# EAGLE design megashield_rs485 (EAGLE 7.6.0)
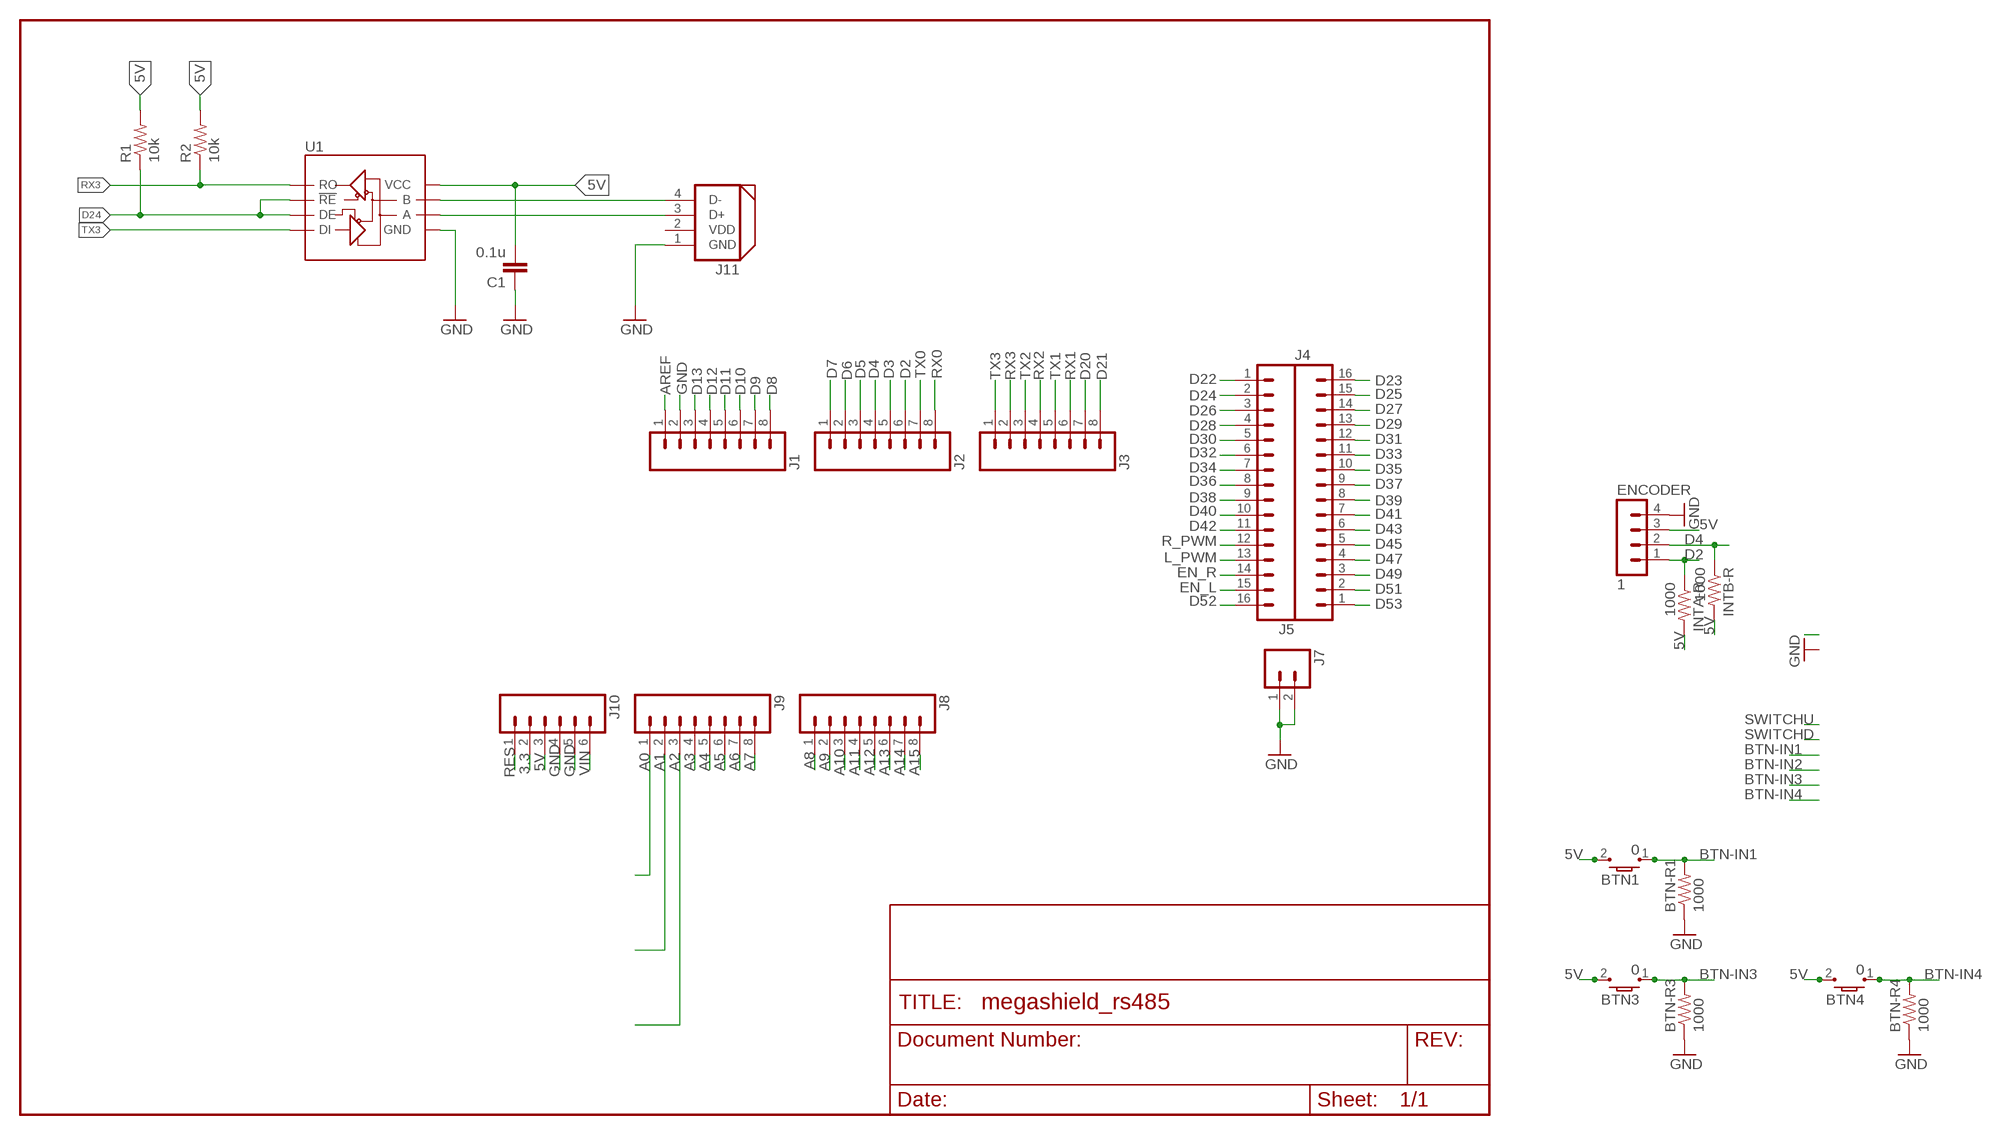
[diagram p0: schematic, sheet 1, part 1 of 2]
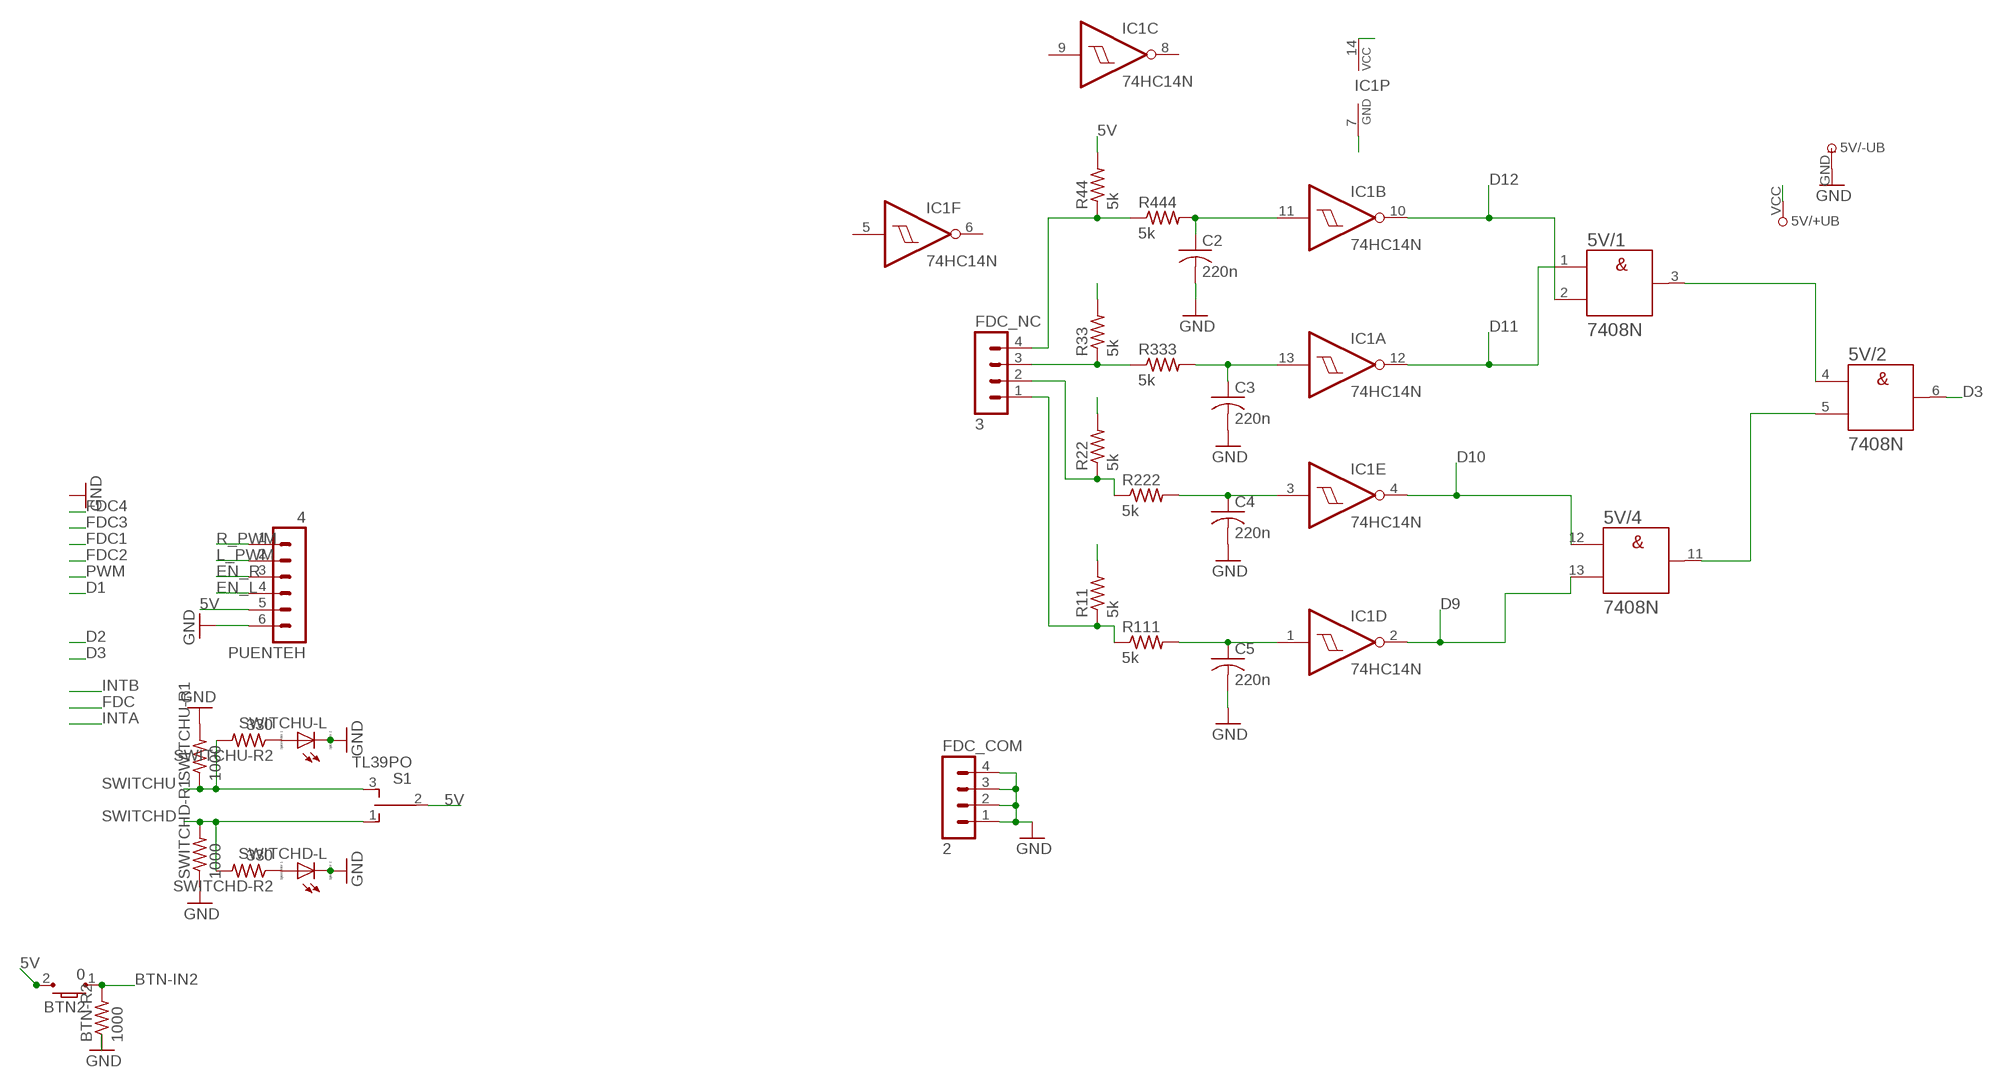
[diagram p1: schematic, sheet 1, part 2 of 2]

## Parts
5V  7408N  [DIL14]
BTN1  0  TL3302-J  [TL3303_J]
BTN2  0  TL3302-J  [TL3303_J]
BTN3  0  TL3302-J  [TL3303_J]
BTN4  0  TL3302-J  [TL3303_J]
BTN-R1  1000  R-US_0204/7  [0204/7]
BTN-R2  1000  R-US_0204/7  [0204/7]
BTN-R3  1000  R-US_0204/7  [0204/7]
BTN-R4  1000  R-US_0204/7  [0204/7]
C1  0.1u  CAPPTH  [CAP-PTH-SMALL]
C2  220n  C-US025-030X050  [C025-030X050]
C3  220n  C-US025-030X050  [C025-030X050]
C4  220n  C-US025-030X050  [C025-030X050]
C5  220n  C-US025-030X050  [C025-030X050]
ENCODER  1  MA04-1  [MA04-1]
FDC_COM  2  MA04-1  [MA04-1]
FDC_NC  3  MA04-1  [MA04-1]
IC1  74HC14N  [DIL14]
INTA-R  1000  R-US_0204/7  [0204/7]
INTB-R  1000  R-US_0204/7  [0204/7]
J1  M08LONGPADS  [1X08_LONGPADS]
J2  M08LONGPADS  [1X08_LONGPADS]
J3  M08LONGPADS  [1X08_LONGPADS]
J4  M16PTH  [1X16]
J5  M16PTH  [1X16]
J7  M02PTH  [1X02]
J8  M08LONGPADS  [1X08_LONGPADS]
J9  M08LONGPADS  [1X08_LONGPADS]
J10  M06LONGPADS  [1X06_LONGPADS]
J11  DYNAMIXEL_RS485  [DYNAMIXEL_SPOX_04]
PUENTEH  4  MA06-1  [MA06-1]
R1  10k  RESISTORPTH-1/4W  [AXIAL-0.4]
R2  10k  RESISTORPTH-1/4W  [AXIAL-0.4]
R11  5k  R-US_0204/7  [0204/7]
R22  5k  R-US_0204/7  [0204/7]
R33  5k  R-US_0204/7  [0204/7]
R44  5k  R-US_0204/7  [0204/7]
R111  5k  R-US_0204/7  [0204/7]
R222  5k  R-US_0204/7  [0204/7]
R333  5k  R-US_0204/7  [0204/7]
R444  5k  R-US_0204/7  [0204/7]
S1  TL39PO  [TL3XPO]
SWITCHD-L  LED_ELD260  [LED_LD260]
SWITCHD-R1  1000  R-US_0204/7  [0204/7]
SWITCHD-R2  330  R-US_0204/7  [0204/7]
SWITCHU-L  LED_ELD260  [LED_LD260]
SWITCHU-R1  1000  R-US_0204/7  [0204/7]
SWITCHU-R2  330  R-US_0204/7  [0204/7]
U1  RS485  SN75176B  [DIL08]

## Nets
3.3: J10.2
5V: 5V.VCC(/+UB:+UB) BTN1.2 BTN2.2 BTN3.2 BTN4.2 C1.2 ENCODER.3 IC1.14(P:VCC) INTA-R.2 INTB-R.2 J10.3 PUENTEH.5 R1.P$2 R2.P$2 R11.2 R22.2 R33.2 R44.2 S1.2(P) U1.8(VCC)
A0: J9.1
A1: J9.2
A2: J9.3
A3: J9.4
A4: J9.5
A5: J9.6
A6: J9.7
A7: J9.8
A8: J8.1
A9: J8.2
A10: J8.3
A11: J8.4
A12: J8.5
A13: J8.6
A14: J8.7
A15: J8.8
AREF: J1.1
BTN-IN1: BTN1.1 BTN-R1.2
BTN-IN2: BTN2.1 BTN-R2.2
BTN-IN3: BTN3.1 BTN-R3.2
BTN-IN4: BTN4.1 BTN-R4.2
D2: ENCODER.1 INTA-R.1 J2.6
D3: 5V.6(/2:Y) J2.5
D4: ENCODER.2 INTB-R.1 J2.4
D5: J2.3
D6: J2.2
D7: J2.1
D8: J1.8
D9: 5V.13(/4:B) IC1.2(D:O) J1.7
D10: 5V.12(/4:A) IC1.4(E:O) J1.6
D11: 5V.1(/1:A) IC1.12(A:O) J1.5
D12: 5V.2(/1:B) IC1.10(B:O) J1.4
D13: J1.3
D20: J3.7
D21: J3.8
D22: J5.1
D23: J4.16
D24: J5.2 R1.P$1 U1.2(!RE) U1.3(DE)
D25: J4.15
D26: J5.3
D27: J4.14
D28: J5.4
D29: J4.13
D30: J5.5
D31: J4.12
D32: J5.6
D33: J4.11
D34: J5.7
D35: J4.10
D36: J5.8
D37: J4.9
D38: J5.9
D39: J4.8
D40: J5.10
D41: J4.7
D42: J5.11
D43: J4.6
D45: J4.5
D47: J4.4
D49: J4.3
D51: J4.2
D52: J5.16
D53: J4.1
EN_L: J5.15 PUENTEH.4
EN_R: J5.14 PUENTEH.3
GND: 5V.GND(/-UB:-UB) BTN-R1.1 BTN-R2.1 BTN-R3.1 BTN-R4.1 C1.1 C2.2 C3.2 C4.2 C5.2 ENCODER.4 FDC_COM.1 FDC_COM.2 FDC_COM.3 FDC_COM.4 IC1.7(P:GND) J1.2 J7.1 J7.2 J10.4 J10.5 J11.1(GND) PUENTEH.6 SWITCHD-L.K(C) SWITCHD-R1.1 SWITCHU-L.K(C) SWITCHU-R1.2 U1.5(GND)
L_PWM: J5.13 PUENTEH.2
N$1: J11.3(D+) U1.6(A)
N$2: J11.4(D-) U1.7(B)
N$3: SWITCHU-L.A SWITCHU-R2.1
N$4: SWITCHD-L.A SWITCHD-R2.1
N$5: FDC_NC.4 R44.1 R444.1
N$6: FDC_NC.3 R33.1 R333.1
N$8: C2.1 IC1.11(B:I) R444.2
N$10: C3.1 IC1.13(A:I) R333.2
N$11: FDC_NC.2 R22.1 R222.1
N$12: C4.1 IC1.3(E:I) R222.2
N$13: FDC_NC.1 R11.1 R111.1
N$14: C5.1 IC1.1(D:I) R111.2
N$19: 5V.5(/2:B) 5V.11(/4:Y)
N$20: 5V.3(/1:Y) 5V.4(/2:A)
R_PWM: J5.12 PUENTEH.1
RES: J10.1
RX0: J2.8
RX1: J3.6
RX2: J3.4
RX3: J3.2 R2.P$1 U1.1(RO)
SWITCHD: S1.1(O) SWITCHD-R1.2 SWITCHD-R2.2
SWITCHU: S1.3(S) SWITCHU-R1.1 SWITCHU-R2.2
TX0: J2.7
TX1: J3.5
TX2: J3.3
TX3: J3.1 U1.4(DI)
VIN: J10.6
Unconnected: 5V.8(/3:Y) 5V.9(/3:A) 5V.10(/3:B) IC1.5(F:I) IC1.6(F:O) IC1.8(C:O) IC1.9(C:I)

## Power pins joined to a net without a drawn wire
VDD: J11.2(VDD)

## Library data of the parts
5V = 74ttl-din:74*08: Quad 2-input AND gate
BTN1-BTN4 = eswitch-tact:TL3302: E-Switch TL3302 Series Tactile Switch Surface mount button commonly used for reset or general input. 3.5 x 6mm packaged design. -G: Gull wing termination. Parts TL-3302-x-xxxx-x-G -J: J-Lead termination. Parts TL-3302-x-xxxx-x-J Source: http://www.e-switch.com/Portals/0/Series_Pdf/TL3302.pdf Supplier: DigiKey: http://be.digikey.com/scripts/dksearch/dksus.dll?vendor=0&keywords=TL3302
BTN-R1-BTN-R4 INTA-R INTB-R SWITCHD-R1 SWITCHD-R2 SWITCHU-R1 SWITCHU-R2 = resistor:R-US_: RESISTOR, American symbol
C1 = mecatronica_eagle_lib:CAP: Capacitor Standard 0603 ceramic capacitor, and 0.1" leaded capacitor.
C2-C5 = rcl:C-US: CAPACITOR, American symbol
ENCODER FDC_COM FDC_NC = con-lstb:MA04-1: PIN HEADER; OC_FARNELL: unknown; OC_NEWARK: unknown
IC1 = 74xx-eu:74*14: Hex schmitt trigger INVERTER
J1-J3 J8 J9 = mecatronica_eagle_lib:M08: Header 8 Standard 8-pin 0.1" header. Use with straight break away headers (SKU : PRT-00116), right angle break away headers (PRT-00553), swiss pins (PRT-00743), machine pins (PRT-00117), and female headers (PRT-00115).
J4 J5 = mecatronica_eagle_lib:M16: 1x16 .1" header
J7 = mecatronica_eagle_lib:M02: Standard 2-pin 0.1" header. Use with - straight break away headers ( PRT-00116) - right angle break away headers (PRT-00553) - swiss pins (PRT-00743) - machine pins (PRT-00117) - female headers (PRT-00115) Molex polarized connector foot print use with: PRT-08233 with associated crimp pins and housings. 2.54_SCREWTERM for use with PRT-10571. 3.5mm Screw Terminal footprints for PRT-08084 5mm Screw Terminal footprints for use with PRT-08432
J10 = mecatronica_eagle_lib:M06: Header 6 Standard 6-pin 0.1" header. Use with straight break away headers (SKU : PRT-00116), right angle break away headers (PRT-00553), swiss pins (PRT-00743), machine pins (PRT-00117), and female headers (PRT-00115). Molex polarized connector foot print use with SKU : PRT-08094 with associated crimp pins and housings. NOTES ON THE VARIANTS LOCK and LOCK_LONGPADS... This footprint was designed to help hold the alignment of a through-hole component (i.e. 6-pin header) while soldering it into place. You may notice that each hole has been shifted either up or down by 0.005 of an inch from it's more standard position (which is a perfectly straight line). This slight alteration caused the pins (the squares in the middle) to touch the edges of the holes. Because they are alternating, it causes a "brace" to hold the component in place. 0.005 has proven to be the perfect amount of "off-center" position when using our standard breakaway headers. Although looks a little odd when you look at the bare footprint, once you have a header in there, the alteration is very hard to notice. Also,if you push a header all the way into place, it is covered up entirely on the bottom side. This idea of altering the position of holes to aid alignment will be further integrated into the Sparkfun Library for other footprints. It can help hold any component with 3 or more connection pins.
J11 = mecatronica_eagle_lib:DYNAMIXEL_RS485: Dynamixel RS-485 Connector Molex LLC SPOX 4 Male connector Digikey code: WM18888-ND
PUENTEH = con-lstb:MA06-1: PIN HEADER; OC_FARNELL: unknown; OC_NEWARK: unknown
R1 R2 = mecatronica_eagle_lib:RESISTOR: Resistor Basic schematic elements and footprints for 0603, 1206, and PTH resistors.
R11 R22 R33 R44 R111 R222 R333 R444 = rcl:R-US_: RESISTOR, American symbol
S1 = switch:TL39PO: TINY SWITCH ON OFF ON Source: http://www2.produktinfo.conrad.com/datenblaetter/700000-724999/705152-da-01-de-Subminiaturschalter_TL_36YO.pdf
SWITCHD-L SWITCHU-L = eagle-ltspice:LED_E: LED Source: http://www.osram.convergy.de Source: www.luxeon.com Source: www.kingbright.com; SPICEMODEL: NONE; SPICEPREFIX: D; SPICETYPE: diode
U1 = mecatronica_eagle_lib:SN75176B: SN75176B Datasheet: http://www.ti.com/lit/ds/symlink/sn75176b.pdf

## Board
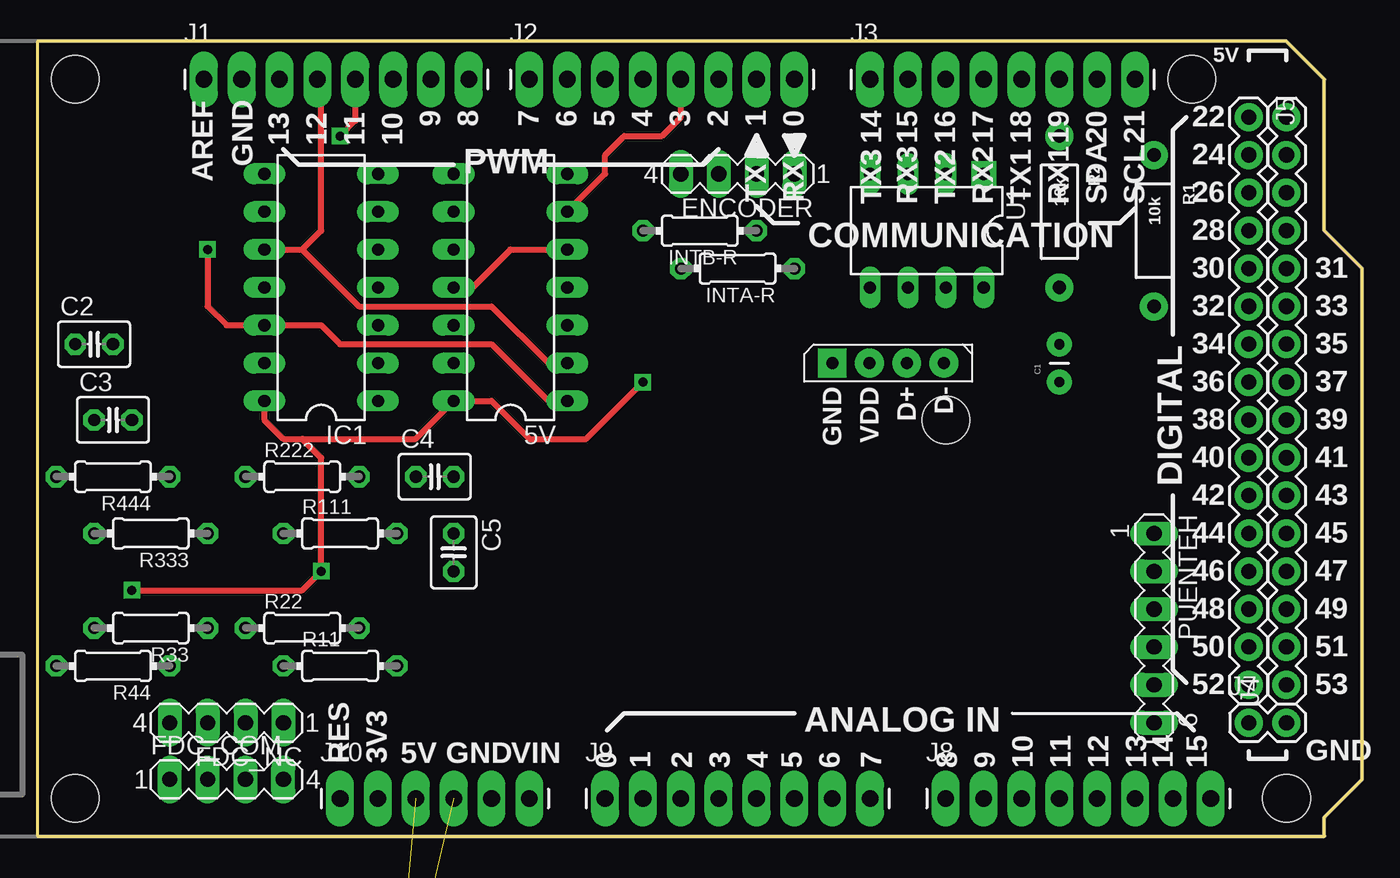
[diagram p2: board, top side]
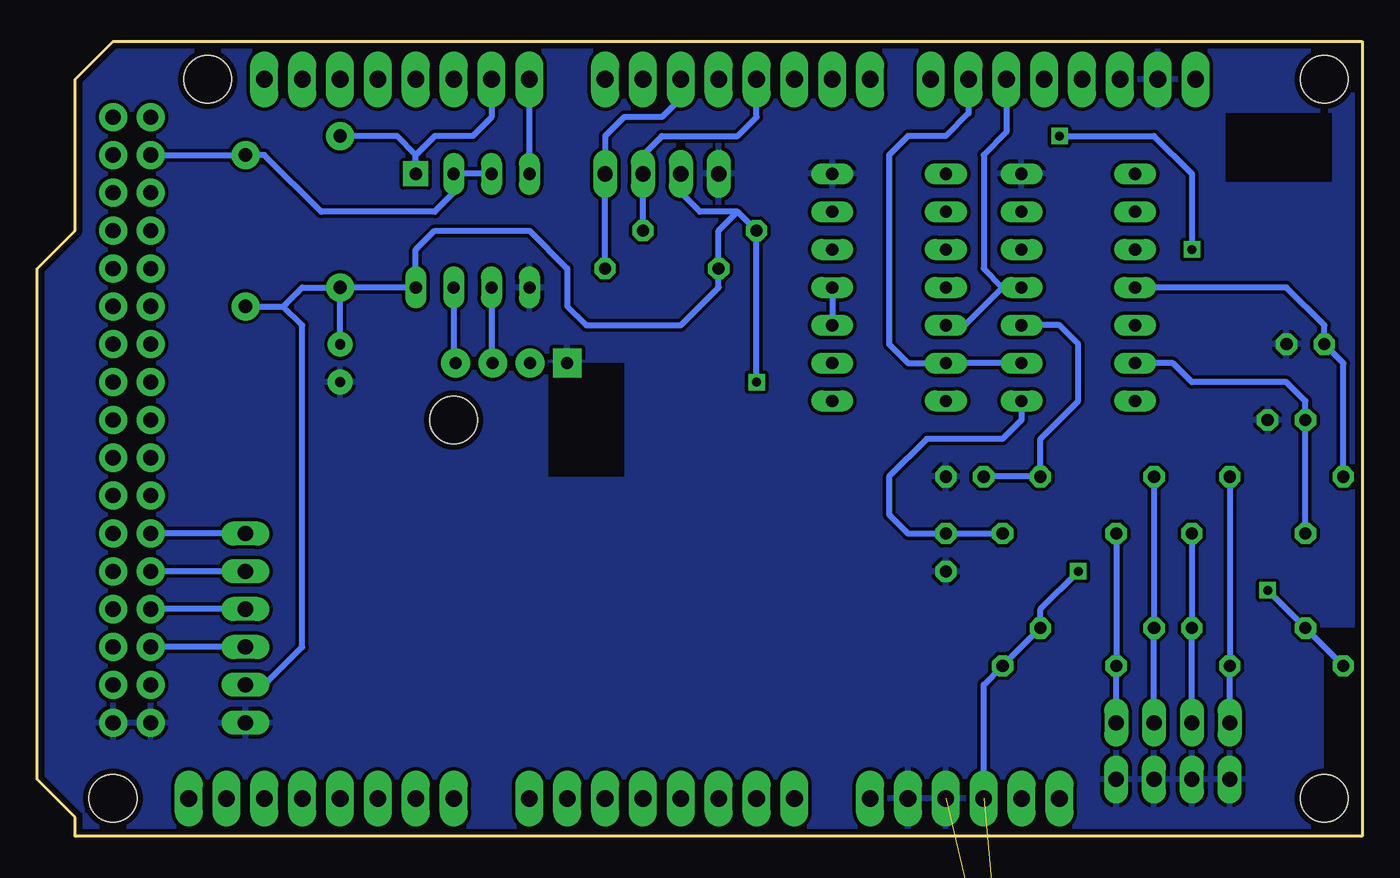
[diagram p3: board, bottom side, seen from below]

Size 88.9 x 53.34 mm. Coordinates in mm from the lower left corner, seen from the top.
Outline: 0,0 86.36,0 86.36,1.27 88.9,3.81 88.9,38.1 86.36,40.64 86.36,50.8 83.82,53.34 0,53.34 0,0
Copper layers (1*16): Top 0.035mm / dielectric 1.5mm / Bottom 0.035mm
Design rules "config_through_hole": minimum track width 8mil, minimum drill 20mil, track to track 9mil, track to pad 9mil, pad to pad 9mil, via to via 9mil, smd to smd 8mil, copper to edge 15mil, drill to drill 8mil, minimum pad ring 12mil, minimum via ring 10mil, stop-mask expansion 4mil, vias tented up to drill 25mil, thermal gap 10mil
Holes 3.2 mm at 2.54,50.8 2.54,2.54 77.47,50.8 83.82,2.54 60.96,27.94
bRestrict: area 49.5,24.1 to 54.6,31.8; area 2,43.9 to 9.1,48.5; area -12.7,30.5 to -1.3,53.3; area -12.7,0 to 2.5,14

### Footprints (pad centres in the part's own frame; a part is rotated, then mirrored left to right if it is on the bottom)
DIL14 = drill 0.813 long: 1 -7.62,-3.81; 2 -5.08,-3.81; 3 -2.54,-3.81; 4 0,-3.81; 5 2.54,-3.81; 6 5.08,-3.81; 8 7.62,3.81; 9 5.08,3.81; 10 2.54,3.81; 11 0,3.81; 12 -2.54,3.81; 13 -5.08,3.81; GND 7.62,-3.81; VCC -7.62,3.81
TL3303_J = smd 2.794 x 2.159: 1 -2.413,0; 2 2.413,0
0204/7 = drill 0.813 octagon: 1 -3.81,0; 2 3.81,0
CAP-PTH-SMALL = drill 0.7 pad 1.651: 1 0,0; 2 2.54,0
C025-030X050 = drill 0.813 octagon: 1 -1.27,0; 2 1.27,0
MA04-1 = drill 1.016 long: 1 -3.81,0; 2 -1.27,0; 3 1.27,0; 4 3.81,0
DIL14' = drill 0.813 long: 1 -7.62,-3.81; 2 -5.08,-3.81; 3 -2.54,-3.81; 4 0,-3.81; 5 2.54,-3.81; 6 5.08,-3.81; 7 7.62,-3.81; 8 7.62,3.81; 9 5.08,3.81; 10 2.54,3.81; 11 0,3.81; 12 -2.54,3.81; 13 -5.08,3.81; 14 -7.62,3.81
1X08_LONGPADS = drill 1.118 pad 1.88 long: 1 0,0; 2 2.54,0; 3 5.08,0; 4 7.62,0; 5 10.16,0; 6 12.7,0; 7 15.24,0; 8 17.78,0
1X16 = drill 1.016 pad 1.88: 1 0,0; 2 2.54,0; 3 5.08,0; 4 7.62,0; 5 10.16,0; 6 12.7,0; 7 15.24,0; 8 17.78,0; 9 20.32,0; 10 22.86,0; 11 25.4,0; 12 27.94,0; 13 30.48,0; 14 33.02,0; 15 35.56,0; 16 38.1,0
1X02 = drill 1.016 pad 1.88: 1 0,0; 2 2.54,0
1X06_LONGPADS = drill 1.118 pad 1.88 long: 1 0,0; 2 2.54,0; 3 5.08,0; 4 7.62,0; 5 10.16,0; 6 12.7,0
DYNAMIXEL_SPOX_04 = drill 0.8 pad 1.93 square: 1 0,0 | drill 0.8 pad 1.93: 2 2.5,0; 3 5,0; 4 7.5,0
MA06-1 = drill 1.016 long: 1 -6.35,0; 2 -3.81,0; 3 -1.27,0; 4 1.27,0; 5 3.81,0; 6 6.35,0
AXIAL-0.4 = drill 0.9 pad 1.88: P$1 -5.08,0; P$2 5.08,0
TL3XPO = drill 1.1 pad 1.422 long: 1 -2.54,0; 2 0,0; 3 2.54,0
LED_LD260 = drill 0.813 octagon: A -1.27,0; K 1.27,0
DIL08 = drill 0.813 pad 1.676 square: 1 -3.81,-3.81 | drill 0.813 long: 2 -1.27,-3.81; 3 1.27,-3.81; 4 3.81,-3.81; 5 3.81,3.81; 6 1.27,3.81; 7 -1.27,3.81; 8 -3.81,3.81

### Placement (x,y rotation side)
5V  31.75,36.83 90 top
BTN1  2.54,-26.67 0 top  (outside the outline)
BTN2  11.43,-26.67 0 top  (outside the outline)
BTN3  20.32,-26.67 0 top  (outside the outline)
BTN4  -15.24,-34.29 0 top  (outside the outline)
BTN-R1  24.13,-46.99 0 top  (outside the outline)
BTN-R2  -13.97,-50.8 0 top  (outside the outline)
BTN-R3  -3.81,-50.8 0 top  (outside the outline)
BTN-R4  6.35,-50.8 0 top  (outside the outline)
C1  68.58,30.48 90 top
C2  3.81,33.02 0 top
C3  5.08,27.94 0 top
C4  26.67,24.13 0 top
C5  27.94,19.05 270 top
ENCODER  46.99,44.45 180 top
FDC_COM  12.7,3.81 0 top
FDC_NC  12.7,7.62 180 top
IC1  74HC14N  [DIL14']  19.05,36.83 90 top
INTA-R  46.99,38.1 180 top
INTB-R  44.45,40.64 180 top
J1  11.18,50.8 0 top
J2  33.02,50.8 0 top
J3  55.88,50.8 0 top
J4  83.82,10.16 90 top
J5  81.28,48.26 270 top
J7  81.28,7.62 0 top
J8  60.96,2.54 0 top
J9  38.1,2.54 0 top
J10  20.32,2.54 0 top
J11  53.34,31.75 0 top
PUENTEH  74.93,13.97 270 top
R1  74.93,40.64 270 top
R2  68.58,41.91 270 top
R11  20.32,11.43 0 top
R22  17.78,13.97 0 top
R33  7.62,13.97 180 top
R44  5.08,11.43 180 top
R111  20.32,20.32 0 top
R222  17.78,24.13 0 top
R333  7.62,20.32 180 top
R444  5.08,24.13 180 top
S1  -12.7,-17.78 0 top  (outside the outline)
SWITCHD-L  -1.27,-40.64 0 top  (outside the outline)
SWITCHD-R1  21.59,-40.64 0 top  (outside the outline)
SWITCHD-R2  -13.97,-46.99 0 top  (outside the outline)
SWITCHU-L  8.89,-40.64 0 top  (outside the outline)
SWITCHU-R1  -1.27,-46.99 0 top  (outside the outline)
SWITCHU-R2  11.43,-46.99 0 top  (outside the outline)
U1  59.69,40.64 180 top

### Tracks (layer width: path | path; a pad name or v marks a point on that pad's centre or on a via)
5V  (via drill 0.6)  (5 unrouted)
  Top 0.406: IC1.14 15.24,27.94 16.51,26.67 17.78,26.67 | 17.78,26.67 25.4,26.67 5V.VCC 30.48,29.21 33.02,26.67 36.83,26.67 v40.64,30.48 | 17.78,26.67 19.05,25.4 v19.05,17.78 17.78,16.51 v6.35,16.51
  Bottom 0.406: R2.P$2 U1.8 63.5,39.37 62.23,40.64 55.88,40.64 53.34,38.1 53.34,35.56 52.07,34.29 45.72,34.29 43.18,36.83 INTA-R.2 43.18,40.64 41.91,41.91 | R1.P$2 72.39,35.56 | 72.39,35.56 71.12,36.83 R2.P$2 | C1.2 R2.P$2 | 41.91,41.91 INTB-R.2 v40.64,30.48 | 41.91,41.91 44.45,41.91 45.72,43.18 ENCODER.3 | J10.3 25.4,10.16 R11.2 R22.2 21.59,15.24 v19.05,17.78 | R44.2 R33.2 v6.35,16.51 | PUENTEH.5 73.66,10.16 71.12,12.7 71.12,34.29 72.39,35.56
BTN-IN1  (1 unrouted)
BTN-IN2  (1 unrouted)
BTN-IN3  (1 unrouted)
BTN-IN4  (1 unrouted)
D2
  Bottom 0.406: INTA-R.1 ENCODER.1 50.8,46.99 49.53,48.26 46.99,48.26 45.72,49.53 J2.6
D3
  Top 0.406: 5V.6 38.1,44.45 38.1,45.72 39.37,46.99 41.91,46.99 43.18,48.26 J2.5
D4
  Bottom 0.406: INTB-R.1 ENCODER.2 48.26,45.72 46.99,46.99 41.91,46.99 40.64,48.26 J2.4
D9
  Bottom 0.406: IC1.2 5V.13 30.48,31.75 31.75,33.02 31.75,45.72 30.48,46.99 27.94,46.99 26.42,48.51 J1.7
D10
  Bottom 0.406: IC1.4 24.13,36.83 | 24.13,36.83 26.67,34.29 5V.12 | J1.6 23.88,47.24 25.4,45.72 25.4,38.1 24.13,36.83
D11  (via drill 0.6)
  Top 0.406: 5V.1 34.29,29.21 30.48,33.02 20.32,33.02 19.05,34.29 IC1.12 12.7,34.29 11.43,35.56 v11.43,39.37 | J1.5 21.34,48.01 v20.32,46.99
  Bottom 0.406: v20.32,46.99 13.97,46.99 11.43,44.45 v11.43,39.37
D12
  Top 0.406: IC1.10 17.78,39.37 | 17.78,39.37 21.59,35.56 30.48,35.56 34.29,31.75 5V.2 | 17.78,39.37 19.05,40.64 19.05,50.55 J1.4
D24
  Bottom 0.406: U1.3 U1.2 60.96,43.18 62.23,41.91 69.85,41.91 73.66,45.72 R1.P$1 J5.2
EN_L
  Bottom 0.406: PUENTEH.4 J5.15
EN_R
  Bottom 0.406: PUENTEH.3 J5.14
GND  (8 unrouted)
  pour Bottom: 0,53.34 83.82,53.34 86.36,53.34 86.36,40.64 88.9,40.64 88.9,0 0,0
L_PWM
  Bottom 0.406: PUENTEH.2 J5.13
N$1
  Bottom 0.406: U1.6 58.42,31.83 J11.3
N$2
  Bottom 0.406: U1.7 60.96,31.87 J11.4
N$3  (1 unrouted)
N$4  (1 unrouted)
N$5
  Bottom 0.406: FDC_NC.4 R44.1 R444.1
N$6
  Bottom 0.406: FDC_NC.3 R33.1 R333.1
N$8
  Bottom 0.406: R444.2 1.27,31.75 C2.1 2.54,34.29 5.08,36.83 IC1.11
N$10
  Bottom 0.406: R333.2 C3.1 3.81,29.21 5.08,30.48 11.43,30.48 12.7,31.75 IC1.13
N$11
  Bottom 0.406: FDC_NC.2 R22.1 R222.1
N$12
  Bottom 0.406: C4.1 R222.2 21.59,26.67 19.05,29.21 19.05,33.02 20.32,34.29 IC1.3
N$13
  Bottom 0.406: FDC_NC.1 R11.1 R111.1
N$14
  Bottom 0.406: R111.2 C5.1 30.48,20.32 31.75,21.59 31.75,24.13 29.21,26.67 24.13,26.67 22.86,27.94 IC1.1
N$19
  Top 0.406: 5V.11 29.21,36.83 31.75,39.37 5V.5
N$20
  Bottom 0.406: 5V.4 5V.3
R_PWM
  Bottom 0.406: PUENTEH.1 J5.12
RX3
  Bottom 0.406: U1.1 63.5,45.72 | 63.5,45.72 64.77,46.99 R2.P$1 | J3.2 58.42,48.26 59.69,46.99 62.23,46.99 63.5,45.72
SWITCHD  (2 unrouted)
SWITCHU  (2 unrouted)
TX3
  Bottom 0.406: U1.4 J3.1

### Text on the board
tPlace: 5V | 9 | 8 | 7 | 6 | 5 | 4 | 3 | 2 | 1 | 0 | 22 | 13 | 12 | 11 | 10 | 14 | 15 | 16 | 17 | 18 | 19 | 20 | 21 | GND | 24 | AREF | PWM | TX | RX | 26 | TX3 | RX3 | TX2 | RX2 | TX1 | RX1 | SDA | SCL | 28 | COMMUNICATION | 30 | 31 | 32 | 33 | 34 | 35 | 36 | 37 | 38 | 39 | 40 | 41 | DIGITAL | 42 | 43 | 44 | 45 | 46 | 47 | 48 | 49 | 50 | 51 | 52 | 53 | ANALOG IN | RES | 3V3 | 5V | GND | VIN | 0 | 1 | 2 | 3 | 4 | 5 | 6 | 7 | 8 | 9 | 10 | 11 | 12 | 13 | 14 | 15 | GND
tDocu: USB | PWR